# EAGLE design OnionPiShield (EAGLE 7.7.0)
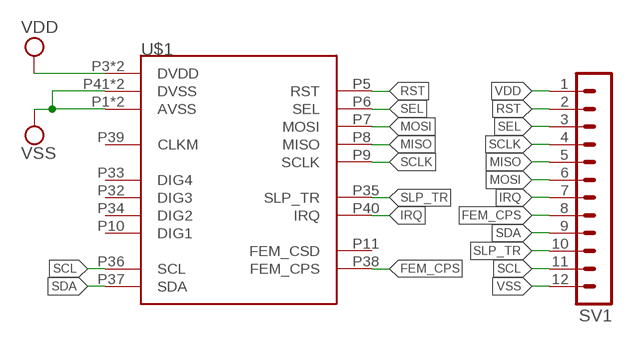
[diagram p0: schematic, sheet 1]

## Parts
SV1  MA12-1  [MA12-1]
U$1  ATZB-RF-233-1-C  [ATZB-RF-233-1-C]

## Nets
FEM_CPS: SV1.8 U$1.P38(FEM_CPS)
IRQ: SV1.7 U$1.P40(IRQ)
MISO: SV1.5 U$1.P8(MISO)
MOSI: SV1.6 U$1.P7(MOSI)
RST: SV1.2 U$1.P5(RST)
SCL: SV1.11 U$1.P36(SCL)
SCLK: SV1.4 U$1.P9(SCLK)
SDA: SV1.9 U$1.P37(SDA)
SEL: SV1.3 U$1.P6(SEL)
SLP_TR: SV1.10 U$1.P35(SLP_TR)
VDD: SV1.1 U$1.P3(DVDD) U$1.P4(DVDD)
VSS: SV1.12 U$1.P1(AVSS) U$1.P2(AVSS) U$1.P41(DVSS) U$1.P42(DVSS)
Unconnected: U$1.P10(DIG1) U$1.P11(FEM_CSD) U$1.P32(DIG3) U$1.P33(DIG4) U$1.P34(DIG2) U$1.P39(CLKM)

## Library data of the parts
SV1 = con-lstb:MA12-1: PIN HEADER; OC_FARNELL: unknown; OC_NEWARK: unknown
U$1 = radios:ATZB-RF-233-1-C

## Board
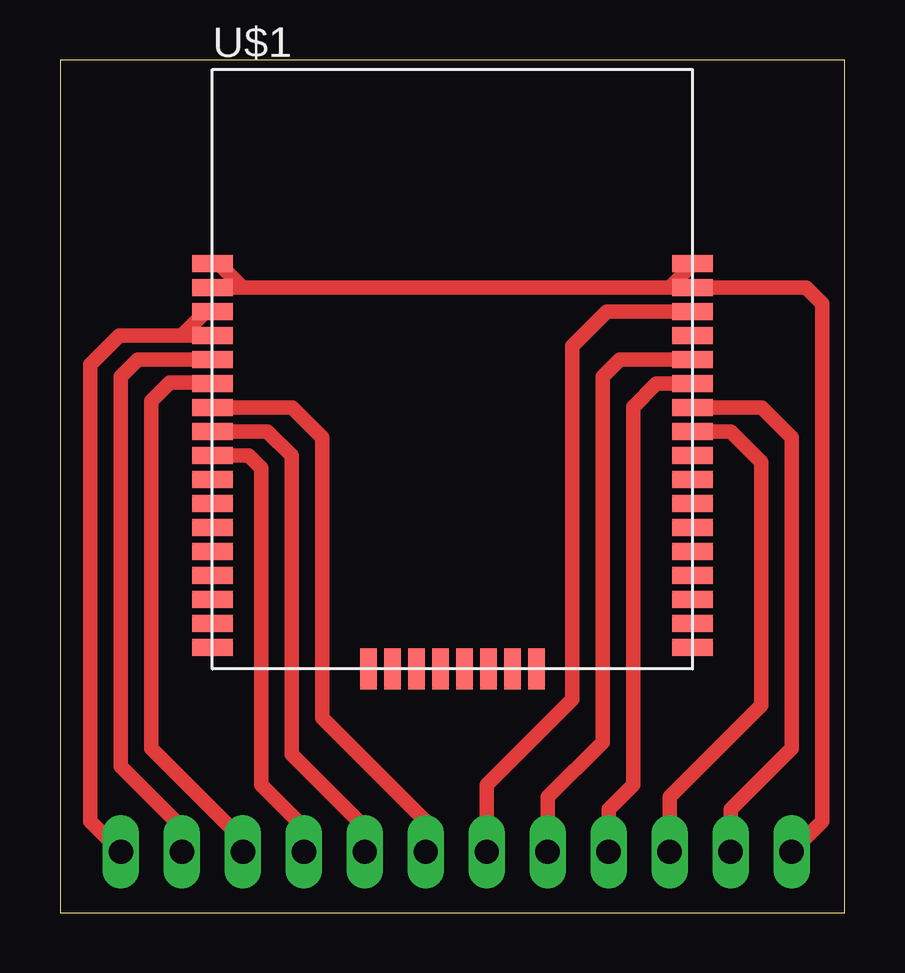
[diagram p1: board, top side]
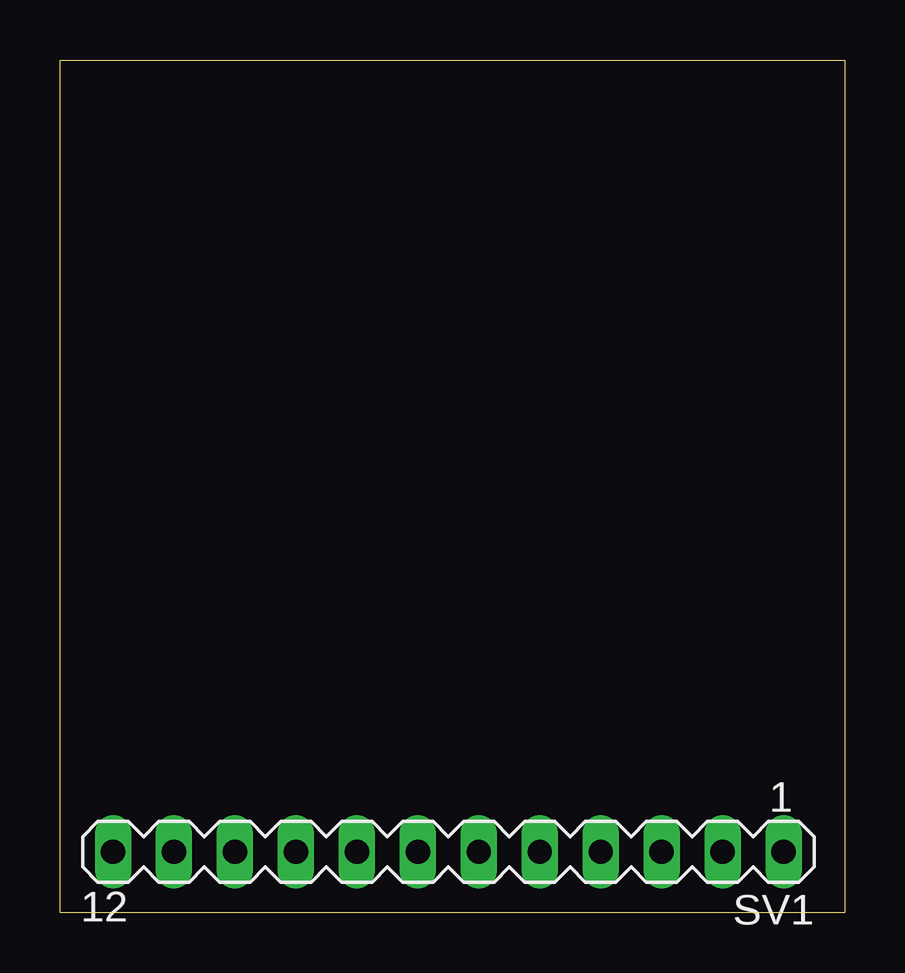
[diagram p2: board, bottom side, seen from below]

Size 32.69 x 35.55 mm. Coordinates in mm from the lower left corner, seen from the top.
Outline: 0,0 32.69,0 32.69,35.55 0,35.55 0,0
Copper layers (1*16): Top 0.035mm / dielectric 1.5mm / Bottom 0.035mm
Design rules "default": minimum track width 10mil, minimum drill 24mil, track to track 8mil, track to pad 8mil, pad to pad 8mil, via to via 8mil, smd to smd 8mil, copper to edge 40mil, drill to drill 8mil, minimum pad ring 10mil, minimum via ring 8mil, stop-mask expansion 4mil, vias tented up to drill 0mil, thermal gap 10mil

### Footprints (pad centres in the part's own frame; a part is rotated, then mirrored left to right if it is on the bottom)
MA12-1 = drill 1.016 long: 1 -13.97,0; 2 -11.43,0; 3 -8.89,0; 4 -6.35,0; 5 -3.81,0; 6 -1.27,0; 7 1.27,0; 8 3.81,0; 9 6.35,0; 10 8.89,0; 11 11.43,0; 12 13.97,0
ATZB-RF-233-1-C = smd 1.7 x 0.7: P1 0,16.9; P2 0,15.9; P3 0,14.9; P4 0,13.9; P5 0,12.9; P6 0,11.9; P7 0,10.9; P8 0,9.9; P9 0,8.9; P10 0,7.9; P11 0,6.9; P12 0,5.9; P13 0,4.9; P14 0,3.9; P15 0,2.9; P16 0,1.9; P17 0,0.9; P26 20,0.9; P27 20,1.9; P28 20,2.9; P29 20,3.9; P30 20,4.9; P31 20,5.9; P32 20,6.9; P33 20,7.9; P34 20,8.9; P35 20,9.9; P36 20,10.9; P37 20,11.9; P38 20,12.9; P39 20,13.9; P40 20,14.9; P41 20,15.9; P42 20,16.9 | smd 0.7 x 1.7: P18 6.5,0; P19 7.5,0; P20 8.5,0; P21 9.5,0; P22 10.5,0; P23 11.5,0; P24 12.5,0; P25 13.5,0

### Placement (x,y rotation side)
SV1  16.51,2.54 180 bottom
U$1  6.35,10.16 0 top

### Tracks (layer width: path | path; a pad name or v marks a point on that pad's centre or on a via)
FEM_CPS
  Top 0.61: U$1.P38 23.31,23.06 22.61,22.35 22.61,7.11 20.32,4.83 SV1.8
IRQ
  Top 0.61: U$1.P40 22.77,25.06 21.34,23.62 21.34,8.89 17.78,5.33 SV1.7
MISO
  Top 0.61: U$1.P8 8.64,20.06 9.65,19.05 9.65,6.6 12.7,3.56 SV1.5
MOSI
  Top 0.61: U$1.P7 9.67,21.06 10.92,19.81 10.92,8.13 15.24,3.81 SV1.6
RST
  Top 0.61: U$1.P5 3.25,23.06 2.54,22.35 2.54,6.1 5.08,3.56 SV1.2
SCL
  Top 0.61: U$1.P36 29.23,21.06 30.48,19.81 30.48,6.86 27.94,4.32 SV1.11
SCLK
  Top 0.61: U$1.P9 7.87,19.05 8.38,18.54 8.38,5.33 10.16,3.56 SV1.4
SDA
  Top 0.61: U$1.P37 24.85,22.06 23.88,21.08 23.88,5.33 22.86,4.32 SV1.9
SEL
  Top 0.61: U$1.P6 6.31,22.1 4.57,22.1 3.81,21.34 3.81,6.86 7.62,3.05 SV1.3
SLP_TR
  Top 0.61: U$1.P35 27.95,20.06 29.21,18.8 29.21,8.64 25.4,4.83 SV1.10
VDD
  Top 0.61: U$1.P4 5.08,24.06 | 5.08,24.06 2.47,24.06 1.27,22.86 1.27,3.81 SV1.1 | U$1.P3 6.08,25.06 5.08,24.06
VSS
  Top 0.61: U$1.P2 7.62,26.06 | 7.62,26.06 25.4,26.06 | 25.4,26.06 U$1.P41 31.09,26.06 31.75,25.4 31.75,3.81 SV1.12 | U$1.P1 6.62,27.06 7.62,26.06 | U$1.P42 26.35,27.01 25.4,26.06